# Altium schematic sheet Disch_Sch.SchDoc
size A4
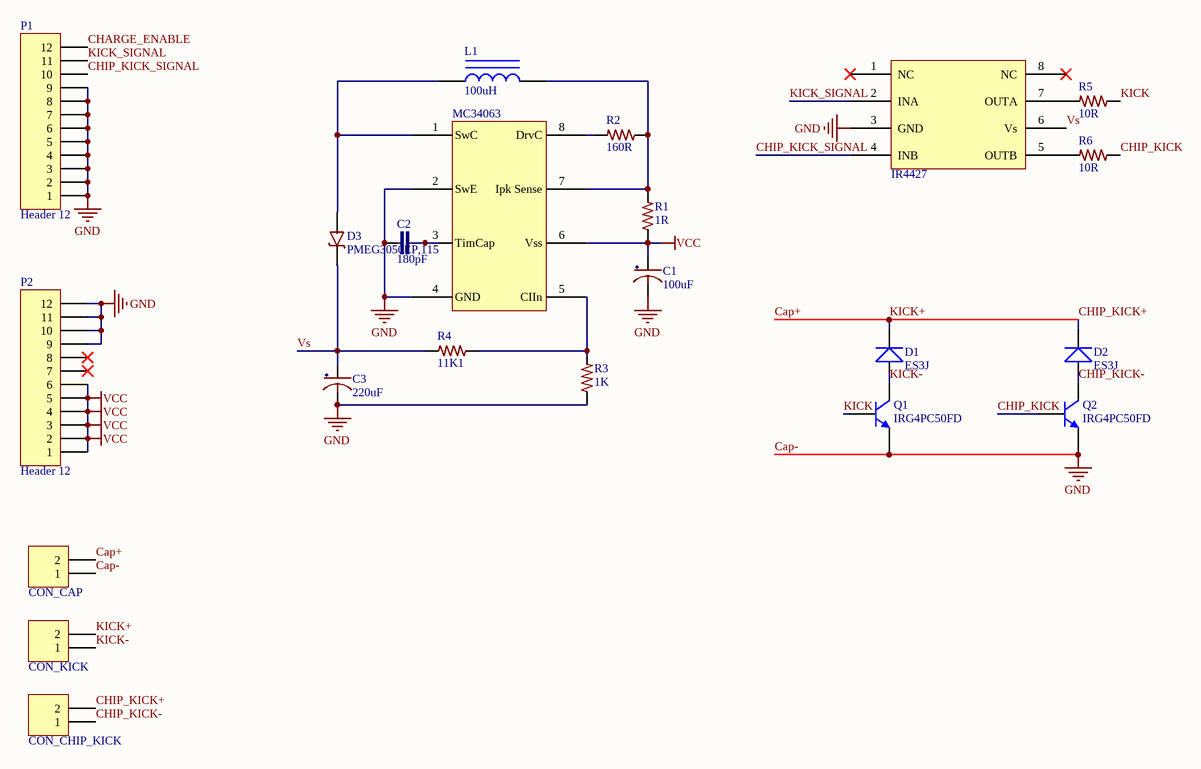
[diagram p0: Disch_Sch.SchDoc]

## Parts
C1  100uF  [7343-CAPPOL]
C2  180pF  [0805-CAP]
C3  220uF  [NIC-CAPA2-10X10_V]
CON_CAP  OSTTA024163  [Term Block 2P]  (value not drawn)
CON_CHIP_KICK  OSTTA024163  [Term Block 2P]  (value not drawn)
CON_KICK  OSTTA024163  [Term Block 2P]  (value not drawn)
D1  ES3J  [Diode]
D2  ES3J  [Diode]
D3  PMEG3050EP,115  [PCBComponent]
IR4427  GATE DRIVER  [IR4427]  (value not drawn)
L1  100uH  [INDUCTOR]
MC34063  Switching Voltage Regulator  [MC34063]  (value not drawn)
P1  Header 12  [HDR1X12]
P2  Header 12  [HDR1X12]
Q1  IRG4PC50FD  [IRG4PC50FD]
Q2  IRG4PC50FD  [IRG4PC50FD]
R1  1R  [0805-RES]
R2  160R  [0805-RES]
R3  1K  [0402-RES-HD]
R4  11K1  [0402-RES-HD]
R5  10R  [0402-RES-HD]
R6  10R  [0402-RES-HD]

## Nets
Cap-: C1.2(-) C2.1 C3.2(-) CON_CAP.1 IR4427.3(GND) MC34063.2(SwE) MC34063.4(GND) P1.1 P1.2 P1.3 P1.4 P1.5 P1.6 P1.7 P1.8 P1.9 P2.9 P2.10 P2.11 P2.12 Q1.3(E) Q2.3(E) R3.1  [also labelled GND]
VCC: C1.1(+) MC34063.6(Vss) P2.1 P2.2 P2.3 P2.4 P2.5 P2.6 R1.1
Cap+: CON_CAP.2 CON_CHIP_KICK.2 CON_KICK.2 D1.D1+ D2.D1+  [also labelled CHIP_KICK+, KICK+]
CHARGE_ENABLE: P1.12
CHIP_KICK: Q2.2(G) R6.2
CHIP_KICK-: CON_CHIP_KICK.1 D2.D1- Q2.1(C)
CHIP_KICK_SIGNAL: IR4427.4(INB) P1.10
KICK: Q1.2(G) R5.2
KICK-: CON_KICK.1 D1.D1- Q1.1(C)
KICK_SIGNAL: IR4427.2(INA) P1.11
Vs: C3.1(+) D3.1(C) IR4427.6(Vs) R4.1
NetC2_2: C2.2 MC34063.3(TimCap)
NetD3_2: D3.2(A) L1.1 MC34063.1(SwC)
NetIR4427_5: IR4427.5(OUTB) R6.1
NetIR4427_7: IR4427.7(OUTA) R5.1
NetL1_2: L1.2 MC34063.7(Ipk_Sense) R1.2 R2.2
NetMC34063_5: MC34063.5(CIIn) R3.2 R4.2
NetMC34063_8: MC34063.8(DrvC) R2.1

Not connected (* = marked no-connect by the designer): IR4427 1(NC)* 8(NC)*; P2 7* 8*

## Library data of the parts
C1 = CT2917-100uF-1: CAP TANT 100uF 25V 20% ESR = 30mOhm @ 100 kHz; Part No: T521X107M025ATE030
C2 = CC0805-180pF-2: CAP CER 180PF 50V NP0 0805; Part No: C0805C181K5GACTU; Cod EMS: 05.281.019.399; Value: 180pF
C3 = CA-220uF-1: CAP ALUM 220uF 20% 50V  ESR = 0,18 ohms  Radial DIA 10mm HEIGH 10,2mm; Part No: EEEFK1H221P; Cod EMS: 05.281.030.094; Value: 220uF
CON_CAP CON_CHIP_KICK CON_KICK = Term Block 2P: 2 Position Wire to Board Terminal Block Horizontal with Board 0.200" (5.08mm) Through Hole
D3 = PMEG3050EP,115-01.A.5: DIODE SCHOTTKY 30V 5A SOD128; Cod EMS: 05.284.051.031; Part No: PMEG3050EP,115
IR4427 = IR4427: IC DRIVER DUAL LOW SIDE 8-SOIC
L1 = Inductor: Fixed Inductors 100uH 0.86A SMT
MC34063 = MC34063
P1 P2 = Header 12: Header, 12-Pin; LatestRevisionDate: 17-Jul-2002; LatestRevisionNote: Re-released for DXP Platform.; Publisher: Altium Limited
Q1 Q2 = IRG4PC50FD: IGBT Transistors 600V FAST 1-8 KHZ COPACK IGBT; Published: 28-dez-2017; DatasheetVersion: 2000; Publisher: RoboIME; ComponentLink2URL: http://www.irf.com/product-info/datasheets/data/irg4pc50fd.pdf
R1 = R0805-1R-1%-1: RES SMD 1 OHM 1% 1/8W 0805; Part No: CRCW08051R00FKEA; Cod EMS: 05.280.029.391; Value: 1R
R2 = R0805-160R-5: RES 160 OHM 1/8W .5% 0805 SMD; Part No: ERA-6AED161V; Cod EMS: 05.280.029.516; Value: 160; Family: ERA-6AED...V
R3 = R0402-1K-A.9: RES 1K OHM 1/10W 1% 0402 SMD; Part No: ERJ-2RKF1001X; Cod EMS: 05.280.029.527; Family Description: RESISTOR FILME ESPESSO 10R-1M / 1/10W / 1% / 0402. P/N: ERJ-2RKF....X – PANASONIC ELECTRONIC COMPONENTS.; Value: 1K; Family: ERJ-2RKF....X
R4 = R0402-11K1-1: RES 11.1 KOHM 1/16W 0.1% 0402 SMD; Part No: TNPW040211K1BEED; Value: 11k1
R5 R6 = R0402-10R-6: RES 10 OHM 1/10W 1% 0402 SMD; Part No: ERJ-2RKF10R0X; Cod EMS: 05.280.029.523; Value: 10; Family Description: RESISTOR FILME ESPESSO 10R-1M / 1/10W / 1% / 0402. P/N: ERJ-2RKF....X – PANASONIC ELECTRONIC COMPONENTS.; Family: ERJ-2RKF....X